# EAGLE design ezo_probe_expansion (3) (1) (EAGLE 9.6.2)
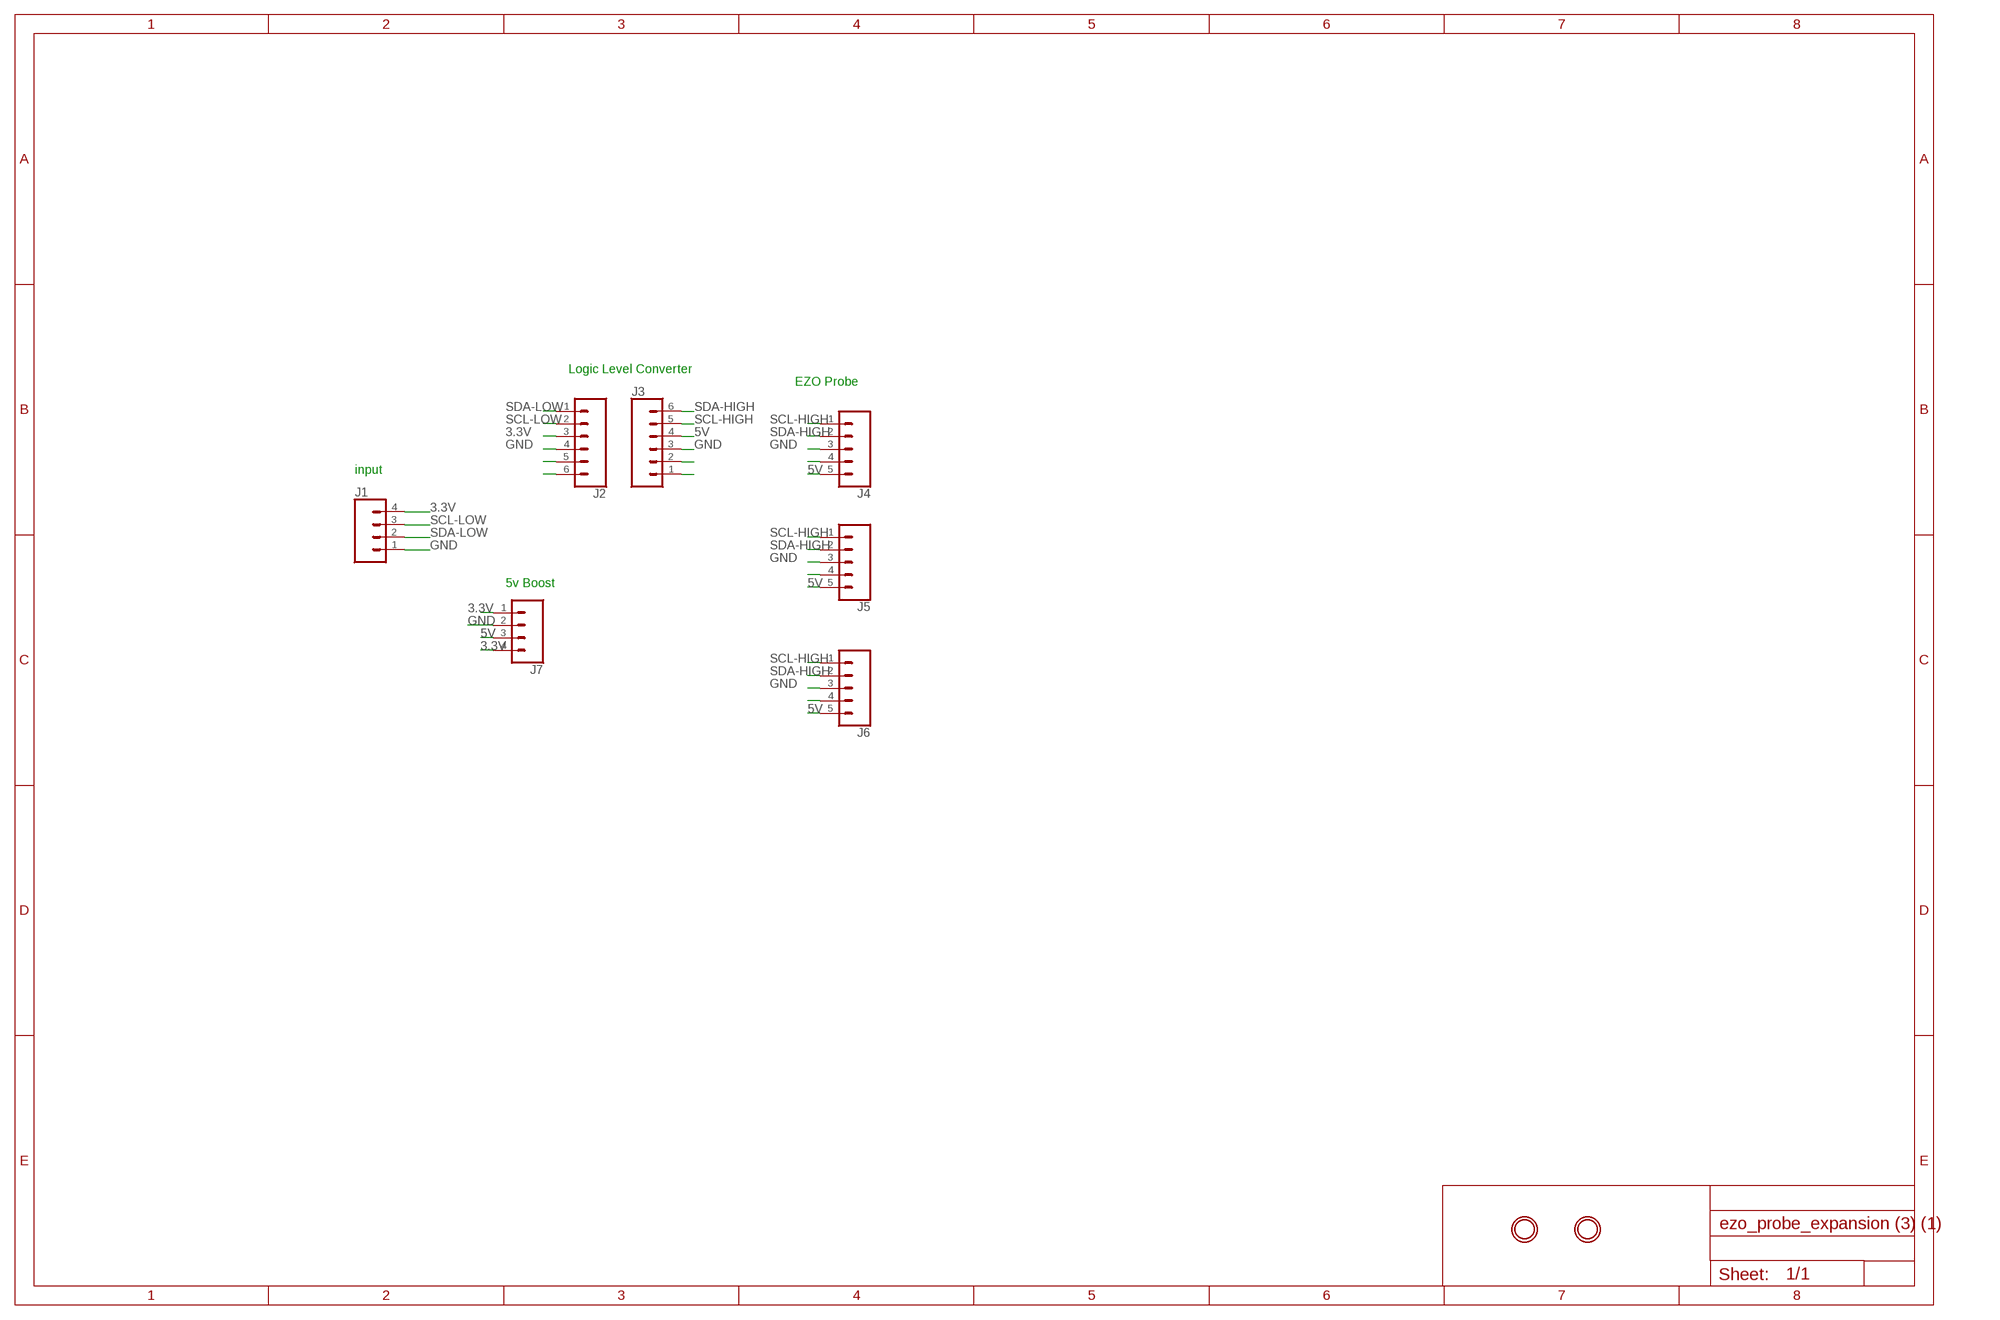
[diagram p0: schematic, sheet 1]

## Parts
J1  CONN_04PTH  [1X04]
J2  CONN_06SILK_FEMALE_PTH  [1X06]
J3  CONN_06SILK_FEMALE_PTH  [1X06]
J4  CONN_05PTH  [1X05]
J5  CONN_05PTH  [1X05]
J6  CONN_05PTH  [1X05]
J7  CONN_04PTH  [1X04]
U$1  MOUNTINGHOLE2.5  [MOUNTINGHOLE_2.5_PLATED]
U$2  MOUNTINGHOLE2.5  [MOUNTINGHOLE_2.5_PLATED]

## Nets
3.3V: J1.4 J2.3 J7.1 J7.4
5V: J3.4 J4.5 J5.5 J6.5 J7.3
GND: J1.1 J2.4 J3.3 J4.3 J5.3 J6.3 J7.2
N$1: J5.4
N$2: J6.4
N$4: J4.4
N$21: J2.5
N$22: J2.6
N$27: J3.2
N$28: J3.1
SCL-HIGH: J3.5 J4.1 J5.1 J6.1
SCL-LOW: J1.3 J2.2
SDA-HIGH: J3.6 J4.2 J5.2 J6.2
SDA-LOW: J1.2 J2.1

## Notes on the sheet
- Logic Level Converter
- EZO Probe
- input
- 5v Boost

## Library data of the parts
J1 J7 = SparkFun-Connectors:CONN_04: Multi connection point. Often used as Generic Header-pin footprint for 0.1 inch spaced/style header connections On any of the 0.1 inch spaced packages, you can populate with these: Break Away Headers - Straight <https://www.sparkfun.com/products/116> (PRT-00116) Break Away Male Headers - Right Angle <https://www.sparkfun.com/products/553> (PRT-00553) Female Headers <https://www.sparkfun.com/products/115> (PRT-00115) Break Away Headers - Machine Pin <https://www.sparkfun.com/products/117> (PRT-00117) Break Away Female Headers - Swiss Machine Pin <https://www.sparkfun.com/products/743> (PRT-00743) For SCREWTERMINALS and SPRING TERMINALS visit here: Screw Terimnals on SparkFun.com <https://www.sparkfun.com/search/results?term=Screw+Terminals> (5mm/3.5mm/2.54mm spacing) This device is also useful as a general connection point to wire up your design to another part of your project. Our various solder wires solder well into these plated through hole pads. Hook-Up Wire - Assortment (Stranded, 22 AWG) <https://www.sparkfun.com/products/11375> (PRT-11375) Hook-Up Wire - Assortment (Solid Core, 22 AWG) <https://www.sparkfun.com/products/11367> (PRT-11367) View the entire wire category on our website here <https://www.sparkfun.com/categories/141> Special notes: Molex polarized connector foot print use with SKU : PRT-08231 with associated crimp pins and housings. 1MM SMD Version SKU: PRT-10208; PROD_ID: CONN-09696
J2 J3 = SparkFun-Connectors:CONN_06: Multi connection point. Often used as Generic Header-pin footprint for 0.1 inch spaced/style header connections On any of the 0.1 inch spaced packages, you can populate with these: Break Away Headers - Straight <https://www.sparkfun.com/products/116> (PRT-00116) Break Away Male Headers - Right Angle <https://www.sparkfun.com/products/553> (PRT-00553) Female Headers <https://www.sparkfun.com/products/115> (PRT-00115) Break Away Headers - Machine Pin <https://www.sparkfun.com/products/117> (PRT-00117) Break Away Female Headers - Swiss Machine Pin <https://www.sparkfun.com/products/743> (PRT-00743) Arduino Stackable Header - 6 Pin <https://www.sparkfun.com/products/9280> (PRT-09280) Screw Terminals 2.54mm Pitch (6-Pin) <https://www.sparkfun.com/products/16499> (PRT-16499) For SCREWTERMINALS and SPRING TERMINALS visit here: Screw Terimnals on SparkFun.com <https://www.sparkfun.com/search/results?term=Screw+Terminals> (5mm/3.5mm/2.54mm spacing) This device is also useful as a general connection point to wire up your design to another part of your project. Our various solder wires solder well into these plated through hole pads. Hook-Up Wire - Assortment (Stranded, 22 AWG) <https://www.sparkfun.com/products/11375> (PRT-11375) Hook-Up Wire - Assortment (Solid Core, 22 AWG) <https://www.sparkfun.com/products/11367> (PRT-11367) View the entire wire category on our website here <https://www.sparkfun.com/categories/141>; PROD_ID: CONN-08437
J4-J6 = SparkFun-Connectors:CONN_05: Multi connection point. Often used as Generic Header-pin footprint for 0.1 inch spaced/style header connections On any of the 0.1 inch spaced packages, you can populate with these: Break Away Headers - Straight <https://www.sparkfun.com/products/116> (PRT-00116) Break Away Male Headers - Right Angle <https://www.sparkfun.com/products/553> (PRT-00553) Female Headers <https://www.sparkfun.com/products/115> (PRT-00115) Break Away Headers - Machine Pin <https://www.sparkfun.com/products/117> (PRT-00117) Break Away Female Headers - Swiss Machine Pin <https://www.sparkfun.com/products/743> (PRT-00743) For SCREWTERMINALS and SPRING TERMINALS visit here: Screw Terimnals on SparkFun.com <https://www.sparkfun.com/search/results?term=Screw+Terminals> (5mm/3.5mm/2.54mm spacing) This device is also useful as a general connection point to wire up your design to another part of your project. Our various solder wires solder well into these plated through hole pads. Hook-Up Wire - Assortment (Stranded, 22 AWG) <https://www.sparkfun.com/products/11375> (PRT-11375) Hook-Up Wire - Assortment (Solid Core, 22 AWG) <https://www.sparkfun.com/products/11367> (PRT-11367) View the entire wire category on our website here <https://www.sparkfun.com/categories/141> Special notes: Molex polarized connector foot print use with SKU : PRT-08231 with associated crimp pins and housings. 1MM SMD Version SKU: PRT-10208
U$1 U$2 = microbuilder:MOUNTINGHOLE: Mounting Hole For #2 screws (0.086"/2.18mm width, 0.094"/2.4mm hole) use 2.5mm

## Board
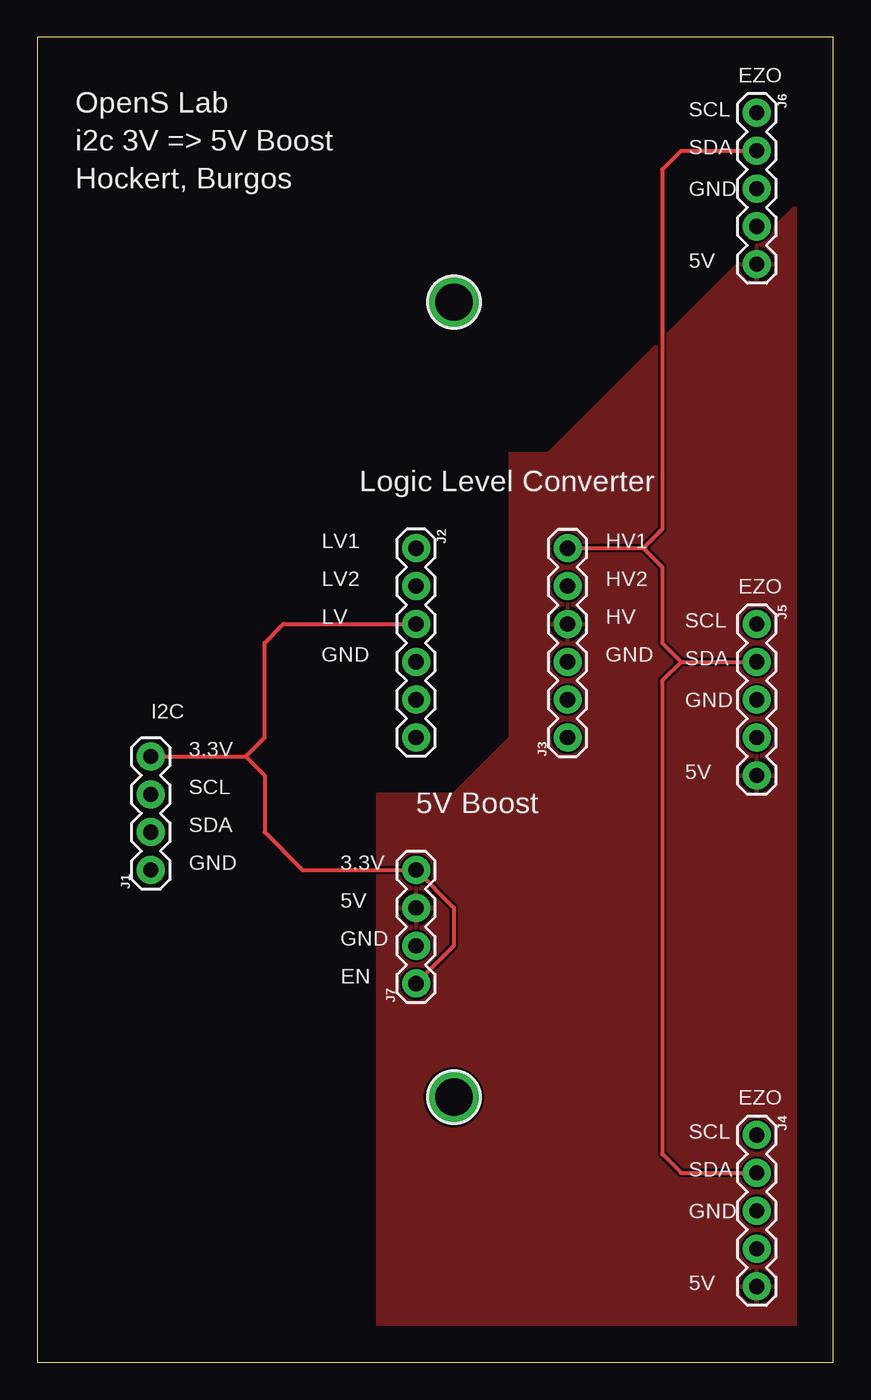
[diagram p1: board, top side]
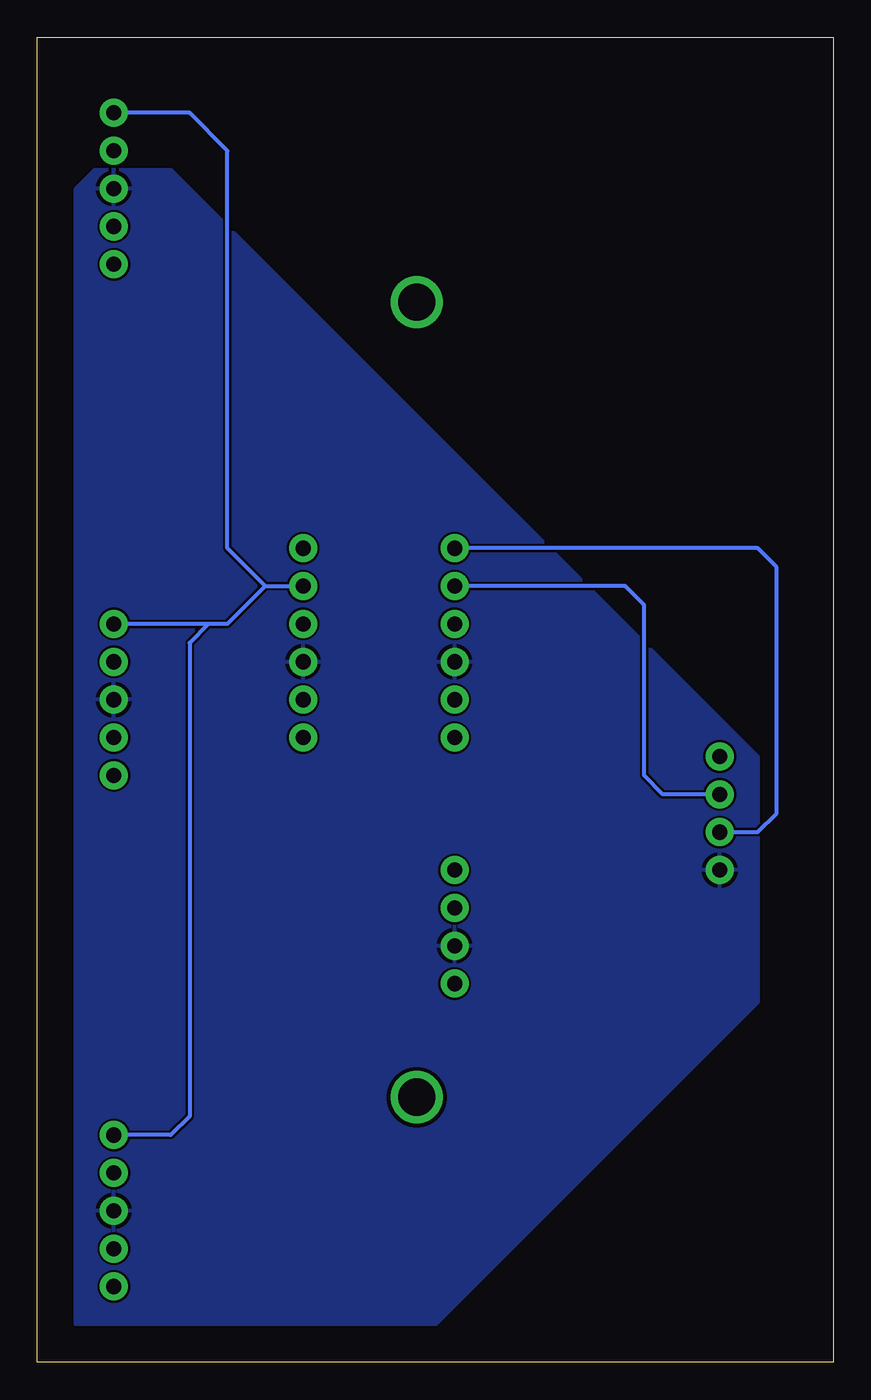
[diagram p2: board, bottom side, seen from below]

Size 53.39 x 88.89 mm. Coordinates in mm from the lower left corner, seen from the top.
Outline: 0,0 53.39,0 53.39,88.89 0,88.89 0,0
Copper layers (1*16): Top 0.035mm / dielectric 1.5mm / Bottom 0.035mm
Design rules "default": minimum track width 6mil, minimum drill 0.35mm, track to track 6mil, track to pad 6mil, pad to pad 6mil, via to via 6mil, smd to smd 6mil, copper to edge 40mil, drill to drill 6mil, minimum pad ring 10mil, minimum via ring 8mil, stop-mask expansion 4mil, vias tented up to drill 0mil, thermal gap 10mil

### Footprints (pad centres in the part's own frame; a part is rotated, then mirrored left to right if it is on the bottom)
1X04 = drill 1.016 pad 1.88: 1 0,0; 2 2.54,0; 3 5.08,0; 4 7.62,0
1X06 = drill 1.016 pad 1.88: 1 0,0; 2 2.54,0; 3 5.08,0; 4 7.62,0; 5 10.16,0; 6 12.7,0
1X05 = drill 1.016 pad 1.88: 1 0,0; 2 2.54,0; 3 5.08,0; 4 7.62,0; 5 10.16,0
MOUNTINGHOLE_2.5_PLATED = drill 2.5 pad 3.2: P$1 0,0

### Placement (x,y rotation side)
J1  7.62,33.02 90 top
J2  25.4,54.61 270 top
J3  35.56,41.91 90 top
J4  48.26,15.24 270 top
J5  48.26,49.53 270 top
J6  48.26,83.82 270 top
J7  25.4,25.4 90 top
U$1  27.94,17.78 90 top
U$2  27.94,71.12 0 top

### Tracks (layer width: path | path; a pad name or v marks a point on that pad's centre or on a via)
3.3V
  Top 0.254: J1.4 13.97,40.64 | 13.97,40.64 15.24,41.91 15.24,48.26 16.51,49.53 J2.3 | 13.97,40.64 15.24,39.37 15.24,35.56 17.78,33.02 J7.4 27.94,30.48 27.94,27.94 J7.1
5V
  pour Top: 22.86,2.54 22.86,38.1 27.94,38.1 31.75,41.91 31.75,60.96 34.29,60.96 50.8,77.47 50.8,2.54
GND
  pour Bottom: 49.53,80.01 44.45,80.01 5.08,40.64 5.08,24.13 26.67,2.54 50.8,2.54 50.8,78.74
SCL-HIGH
  Bottom 0.254: 41.91,49.53 40.64,49.53 38.1,52.07 | 41.91,49.53 J5.1 | 41.91,49.53 43.18,48.26 43.18,16.51 44.45,15.24 J4.1 | 38.1,52.07 40.64,54.61 40.64,81.28 43.18,83.82 J6.1 | 38.1,52.07 J3.5
SCL-LOW
  Bottom 0.254: J1.3 11.43,38.1 12.7,39.37 12.7,50.8 13.97,52.07 J2.2
SDA-HIGH
  Top 0.254: J3.6 40.64,54.61 | J6.2 43.18,81.28 41.91,80.01 41.91,55.88 40.64,54.61 | 40.64,54.61 41.91,53.34 41.91,48.26 43.18,46.99 | 43.18,46.99 J5.2 | 43.18,46.99 41.91,45.72 41.91,13.97 43.18,12.7 J4.2
SDA-LOW
  Bottom 0.254: J1.2 5.08,35.56 3.81,36.83 3.81,53.34 5.08,54.61 J2.1

### Text on the board
tPlace: EZO | OpenS Lab | SCL | i2c 3V => 5V Boost | SDA | Hockert, Burgos | GND | 5V | Logic Level Converter | LV1 | HV1 | LV2 | HV2 | EZO | LV | HV | SCL | GND | GND | SDA | I2C | GND | 3.3V | 5V | SCL | 5V Boost | SDA | GND | 3.3V | 5V | GND | EN | EZO | SCL | SDA | GND | 5V